# Altium schematic sheet MCU.SchDoc
size 420 x 297 mm; SheetNumber: 12; SheetTotal: 12
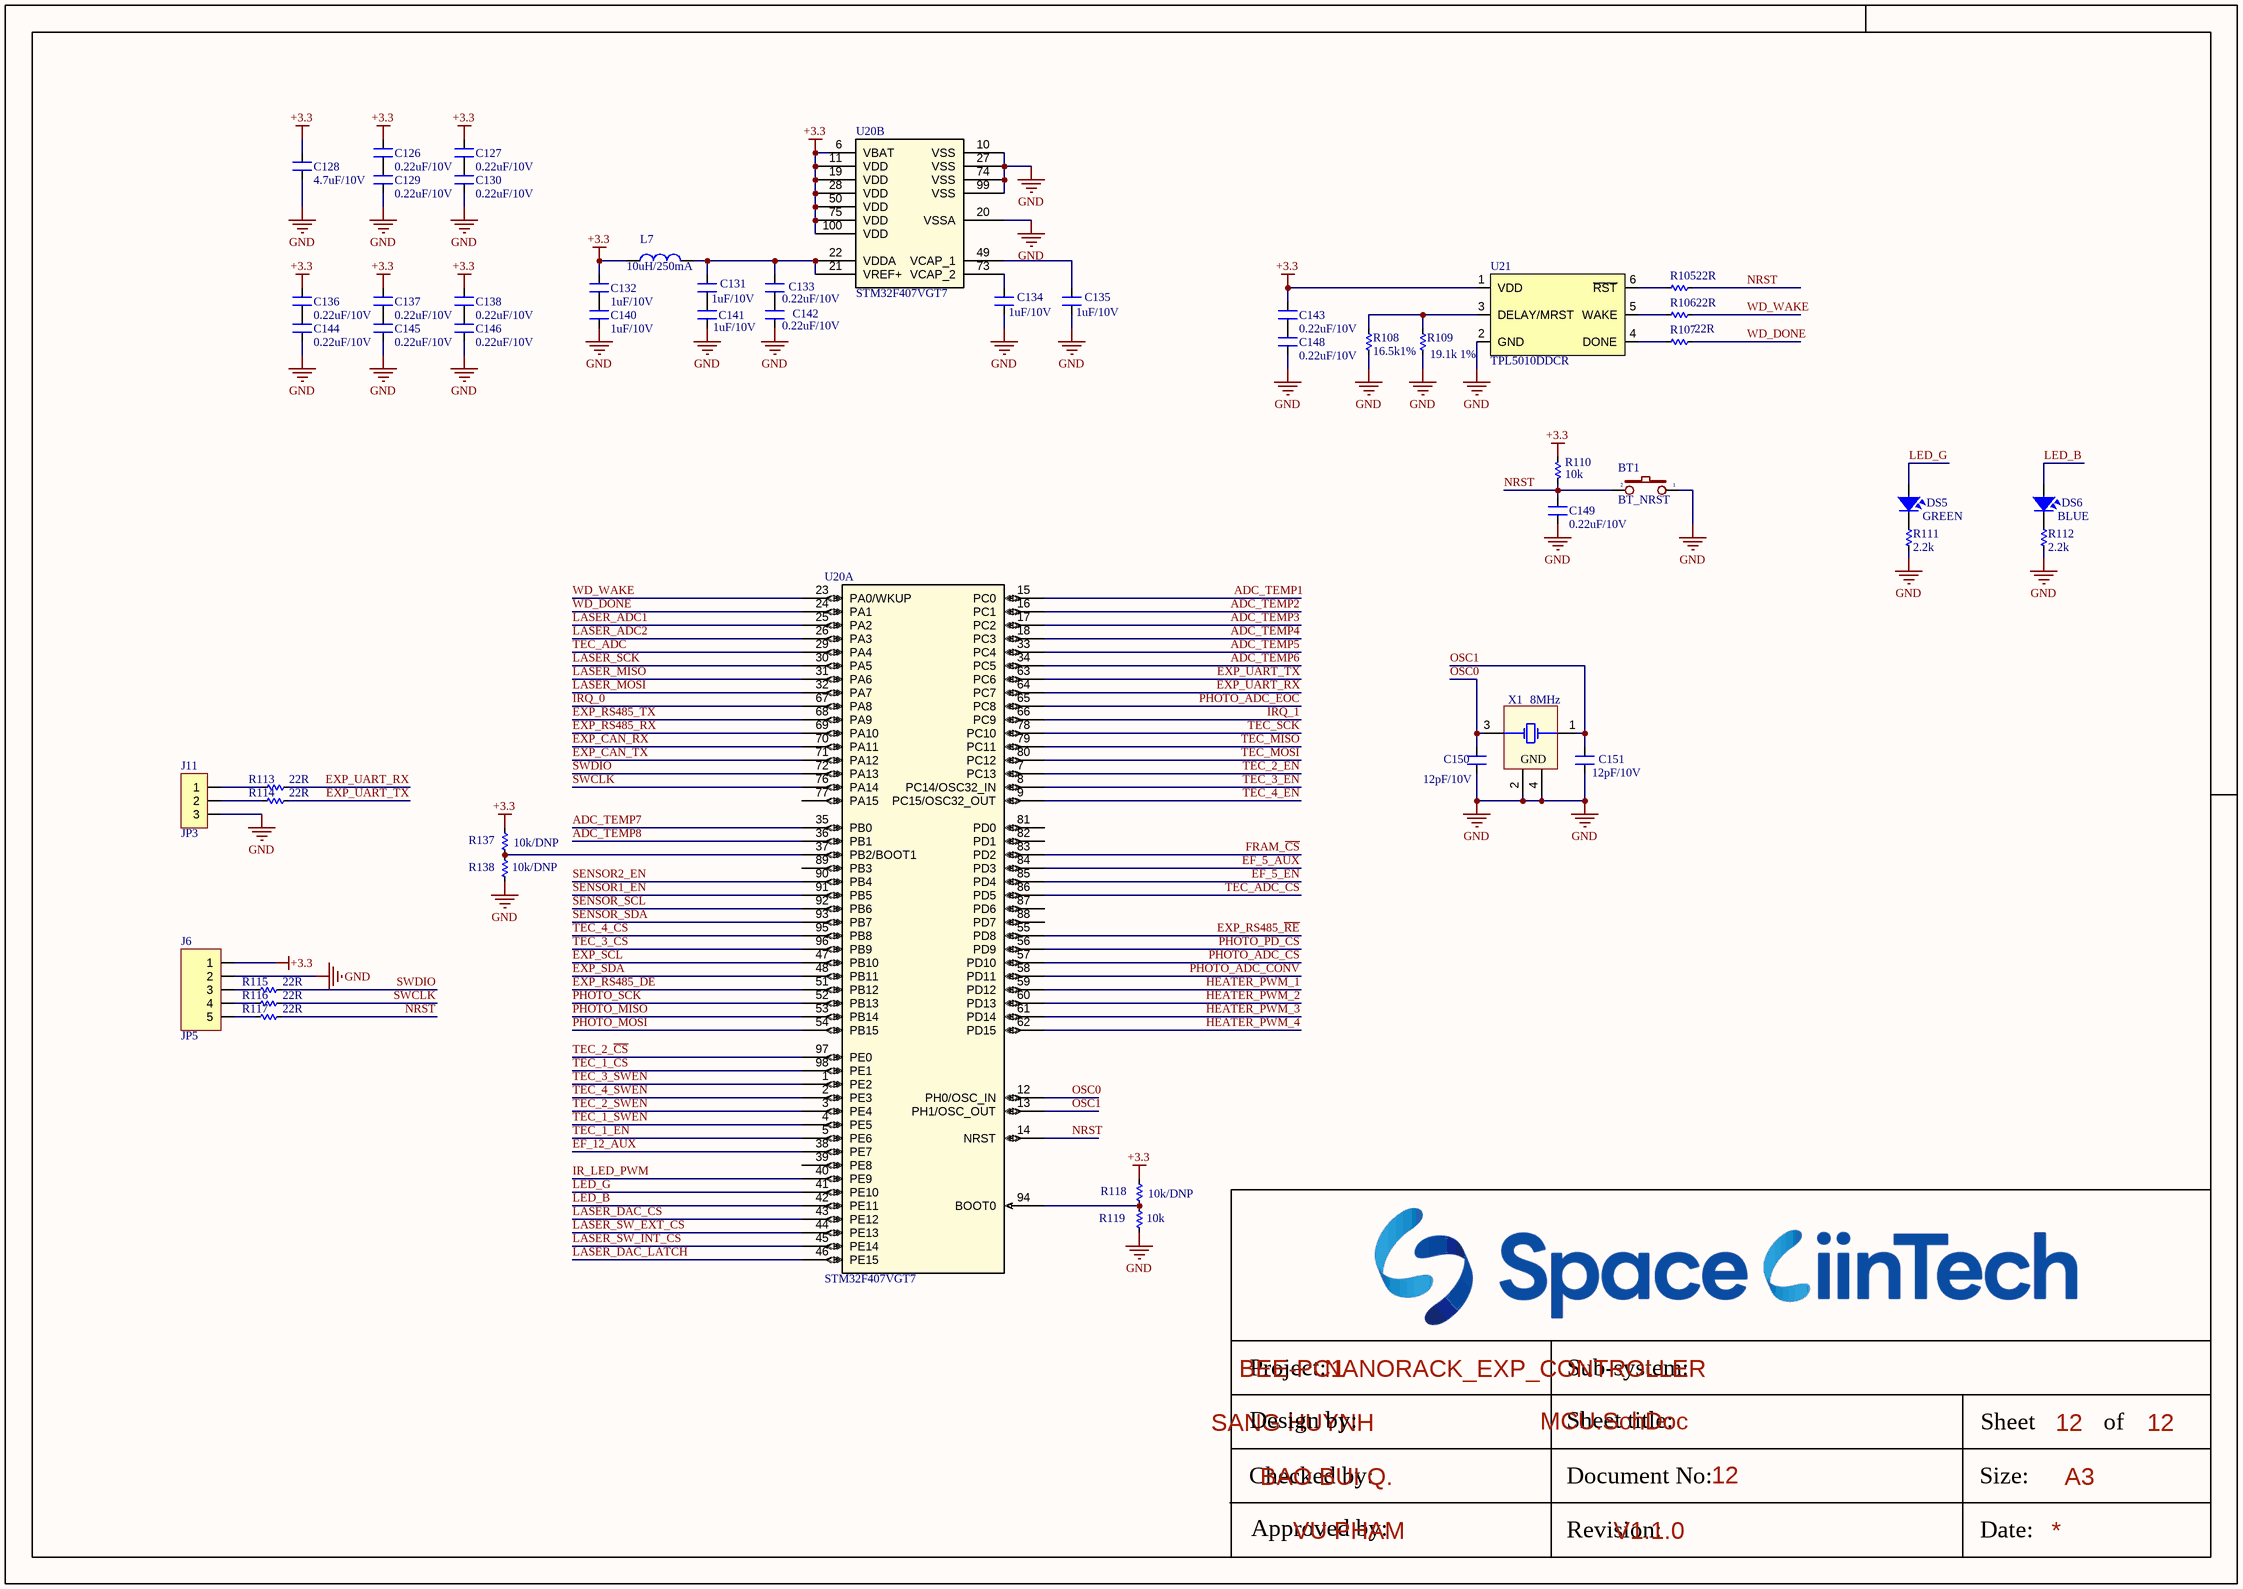
[diagram p0: MCU.SchDoc]

## Parts
BT1  BT_NRST  [SW1-SMD]
C126  0.22uF/10V  [CAP_C_1608X80]
C127  0.22uF/10V  [CAP_C_1608X80]
C128  4.7uF/10V  [CAP_C_1608X80]
C129  0.22uF/10V  [CAP_C_1608X80]
C130  0.22uF/10V  [CAP_C_1608X80]
C131  1uF/10V  [CAP_C_1608X80]
C132  1uF/10V  [CAP_C_1608X80]
C133  0.22uF/10V  [CAP_C_1608X80]
C134  1uF/10V  [CAP_C_1608X80]
C135  1uF/10V  [CAP_C_1608X80]
C136  0.22uF/10V  [CAP_C_1608X80]
C137  0.22uF/10V  [CAP_C_1608X80]
C138  0.22uF/10V  [CAP_C_1608X80]
C140  1uF/10V  [CAP_C_1608X80]
C141  1uF/10V  [CAP_C_1608X80]
C142  0.22uF/10V  [CAP_C_1608X80]
C143  0.22uF/10V  [CAP_C_1608X80]
C144  0.22uF/10V  [CAP_C_1608X80]
C145  0.22uF/10V  [CAP_C_1608X80]
C146  0.22uF/10V  [CAP_C_1608X80]
C148  0.22uF/10V  [CAP_C_1608X80]
C149  0.22uF/10V  [CAP_C_1608X80]
C150  12pF/10V  [CAP_C_1608X80]
C151  12pF/10V  [CAP_C_1608X80]
DS5  GREEN  [LED-0603-BLUE-EXP-V110]
DS6  BLUE  [LED-0603-BLUE-EXP-V110]
J6  JP5  [JP5-D1C]
J11  JP3  [JP3-D1C]
L7  10uH/250mA  [L-SMD-0603-EXP-V101]
R105  22R  [RES_C_1608X60]
R106  22R  [RES_C_1608X60]
R107  22R  [RES_C_1608X60]
R108  16.5k1%  [RES_C_1608X60]
R109  19.1k 1%  [RES_C_1608X60]
R110  10k  [RES_C_1608X60]
R111  2.2k  [RES_C_1608X60]
R112  2.2k  [RES_C_1608X60]
R113  22R  [RES_C_1608X60]
R114  22R  [RES_C_1608X60]
R115  22R  [RES_C_1608X60]
R116  22R  [RES_C_1608X60]
R117  22R  [RES_C_1608X60]
R118  10k/DNP  [RES_C_1608X60]
R119  10k  [RES_C_1608X60]
R137  10k/DNP  [RES_C_1608X60]
R138  10k/DNP  [RES_C_1608X60]
U20  STM32F407VGT7  [LQFP-100-EXP-V110]  (parts A,B of 2)
U21  TPL5010DDCR  [TPL5010DDCR_EXP_V110]
X1  8MHz  [XT4-16.000MHz-4_V]

## Nets
+3.3: C126.2 C127.2 C128.2 C132.2 C136.2 C137.2 C138.2 C143.2 J6.1 L7.1 R110.1 R118.1 R137.1 U20.6(VBAT) U20.11(VDD) U20.19(VDD) U20.28(VDD) U20.50(VDD) U20.75(VDD) U20.100(VDD) U21.1(VDD)
GND: BT1.1 C128.1 C129.1 C130.1 C134.1 C135.1 C140.1 C141.1 C142.1 C144.1 C145.1 C146.1 C148.1 C149.1 C150.2 C151.1 J6.2 J11.3 R108.1 R109.1 R111.2 R112.2 R119.2 R138.2 U20.10(VSS) U20.20(VSSA) U20.27(VSS) U20.74(VSS) U20.99(VSS) U21.2(GND) X1.2(GND) X1.4(GND)
ADC_TEMP1: U20.15(PC0)
ADC_TEMP2: U20.16(PC1)
ADC_TEMP3: U20.17(PC2)
ADC_TEMP4: U20.18(PC3)
ADC_TEMP5: U20.33(PC4)
ADC_TEMP6: U20.34(PC5)
ADC_TEMP7: U20.35(PB0)
ADC_TEMP8: U20.36(PB1)
EF_5_AUX: U20.84(PD3)
EF_5_EN: U20.85(PD4)
EF_12_AUX: U20.38(PE7)
EXP_CAN_RX: U20.70(PA11)
EXP_CAN_TX: U20.71(PA12)
EXP_RS485_DE: U20.51(PB12)
EXP_RS485_~{RE}: U20.55(PD8)
EXP_RS485_RX: U20.69(PA10)
EXP_RS485_TX: U20.68(PA9)
EXP_SCL: U20.47(PB10)
EXP_SDA: U20.48(PB11)
EXP_UART_RX: R113.1 U20.64(PC7)
EXP_UART_TX: R114.1 U20.63(PC6)
FRAM_~{CS}: U20.83(PD2)
HEATER_PWM_1: U20.59(PD12)
HEATER_PWM_2: U20.60(PD13)
HEATER_PWM_3: U20.61(PD14)
HEATER_PWM_4: U20.62(PD15)
IR_LED_PWM: U20.40(PE9)
IRQ_0: U20.67(PA8)
IRQ_1: U20.66(PC9)
LASER_ADC1: U20.25(PA2)
LASER_ADC2: U20.26(PA3)
LASER_DAC_CS: U20.43(PE12)
LASER_DAC_LATCH: U20.46(PE15)
LASER_MISO: U20.31(PA6)
LASER_MOSI: U20.32(PA7)
LASER_SCK: U20.30(PA5)
LASER_SW_EXT_CS: U20.44(PE13)
LASER_SW_INT_CS: U20.45(PE14)
LED_B: DS6.1 U20.42(PE11)
LED_G: DS5.1 U20.41(PE10)
NRST: BT1.2 C149.2 R105.2 R110.2 R117.1 U20.14(NRST)
OSC0: C150.1 U20.12(PH0/OSC_IN) X1.3(XTAL)
OSC1: C151.2 U20.13(PH1/OSC_OUT) X1.1(XTAL)
PHOTO_ADC_CONV: U20.58(PD11)
PHOTO_ADC_CS: U20.57(PD10)
PHOTO_ADC_EOC: U20.65(PC8)
PHOTO_MISO: U20.53(PB14)
PHOTO_MOSI: U20.54(PB15)
PHOTO_PD_CS: U20.56(PD9)
PHOTO_SCK: U20.52(PB13)
SENSOR1_EN: U20.91(PB5)
SENSOR2_EN: U20.90(PB4)
SENSOR_SCL: U20.92(PB6)
SENSOR_SDA: U20.93(PB7)
SWCLK: R116.1 U20.76(PA14)
SWDIO: R115.1 U20.72(PA13)
TEC_1_~{CS}: U20.98(PE1)
TEC_1_EN: U20.5(PE6)
TEC_1_SWEN: U20.4(PE5)
TEC_2_~{CS}: U20.97(PE0)
TEC_2_EN: U20.7(PC13)
TEC_2_SWEN: U20.3(PE4)
TEC_3_~{CS}: U20.96(PB9)
TEC_3_EN: U20.8(PC14/OSC32_IN)
TEC_3_SWEN: U20.1(PE2)
TEC_4_~{CS}: U20.95(PB8)
TEC_4_EN: U20.9(PC15/OSC32_OUT)
TEC_4_SWEN: U20.2(PE3)
TEC_ADC: U20.29(PA4)
TEC_ADC_~{CS}: U20.86(PD5)
TEC_MISO: U20.79(PC11)
TEC_MOSI: U20.80(PC12)
TEC_SCK: U20.78(PC10)
WD_DONE: R107.2 U20.24(PA1)
WD_WAKE: R106.2 U20.23(PA0/WKUP)
NetC126_1: C126.1 C129.2
NetC127_1: C127.1 C130.2
NetC131_1: C131.1 C141.2
NetC131_2: C131.2 C133.2 L7.2 U20.21(VREF+) U20.22(VDDA)
NetC132_1: C132.1 C140.2
NetC133_1: C133.1 C142.2
NetC134_2: C134.2 U20.73(VCAP_2)
NetC135_2: C135.2 U20.49(VCAP_1)
NetC136_1: C136.1 C144.2
NetC137_1: C137.1 C145.2
NetC138_1: C138.1 C146.2
NetC143_1: C143.1 C148.2
NetDS5_2: DS5.2 R111.1
NetDS6_2: DS6.2 R112.1
NetJ6_3: J6.3 R115.2
NetJ6_4: J6.4 R116.2
NetJ6_5: J6.5 R117.2
NetJ11_1: J11.1 R113.2
NetJ11_2: J11.2 R114.2
NetR105_1: R105.1 U21.6(~{RST})
NetR106_1: R106.1 U21.5(WAKE)
NetR107_1: R107.1 U21.4(DONE)
NetR108_2: R108.2 R109.2 U21.3(DELAY/MRST)
NetR118_2: R118.2 R119.1 U20.94(BOOT0)
NetR137_2: R137.2 R138.1 U20.37(PB2/BOOT1)

Not connected (* = marked no-connect by the designer): U20 39(PE8) 77(PA15) 81(PD0) 82(PD1) 87(PD6) 88(PD7) 89(PB3)

## Notes on the sheet
- Project:
- BEE-PC1
- Sub-system:
- NANORACK_EXP_CONTROLLER
- Design by:
- SANG HUYNH
- BAO BUI Q.
- Sheet title:
- Sheet
- A3
- of
- Checked by:
- Approved by:
- VU PHAM
- Revision:
- Document No:
- V1.1.0
- Size:
- Date:

## Library data of the parts
BT1 = SW2: Switch button 2 pin; Value: SW chip 2 pin
C126-C138 C140-C146 C148-C151 = Capacitors: Value: 33pF
DS5 DS6 = LED SMD: Value: LED 3 - 5 ly 2 Colour
J6 = JP5: WR-PHD 2.54 mm Angled Socket Header; Manufacturer: W¨¹rth Elektronik eiSos GmbH; partNo: 613005143121; ComponentLink1 Description: Manufacturer; ComponentLink2 Description: Datasheet; NoPins: 05; Created Date: 29 March 2013; ComponentLink1URL: http://www.we-online.com; ComponentLink2URL: http://katalog.we-online.de/em/datasheet/6130xx143121.pdf; Created by: Karrer Zheng
J11 = JP3: WR-PHD 2.54 mm Angled Socket Header; Manufacturer: W¨¹rth Elektronik eiSos GmbH; partNo: 613003143121; ComponentLink1 Description: Manufacturer; ComponentLink2 Description: Datasheet; NoPins: 03; Created Date: 29 March 2013; ComponentLink1URL: http://www.we-online.com; ComponentLink2URL: http://katalog.we-online.de/em/datasheet/6130xx143121.pdf; Created by: Karrer Zheng
L7 = L-SMD-1: partNo: 78477010; Manufacturer: Wurth Elektronik; Inductance: 1.0 μH; ComponentLink1Description: Manufacturer; ComponentLink1URL: http://www.we-online.de; Created by: Baojun Chen; Created Date: Nov.2015; ComponentLink2Description: Datasheet; ComponentLink2URL: http://katalog.we-online.de/pbs/datasheet/78477010.pdf
R105-R119 R137 R138 = Res SMD: SMD; Manufacturer: Generic Components; Class: Passive; Published: 08/06/2000; Publisher: Altium Hobart Technology Centre
U20 = STM32F407VGT7: ARM® Cortex®-M4 STM32F4 Microcontroller IC 32-Bit Single-Core 168MHz 1MB (1M x 8) FLASH 100-LQFP (14x14)
U21 = TPL5010DDCR: IC OSC PROG TIMER TSOT23-6
X1 = XT4: Crystal, 8 MHz, -30 to 85 degC, 3.2 x 2.5 x 0.9 mm SMD; Value: 4Mhz